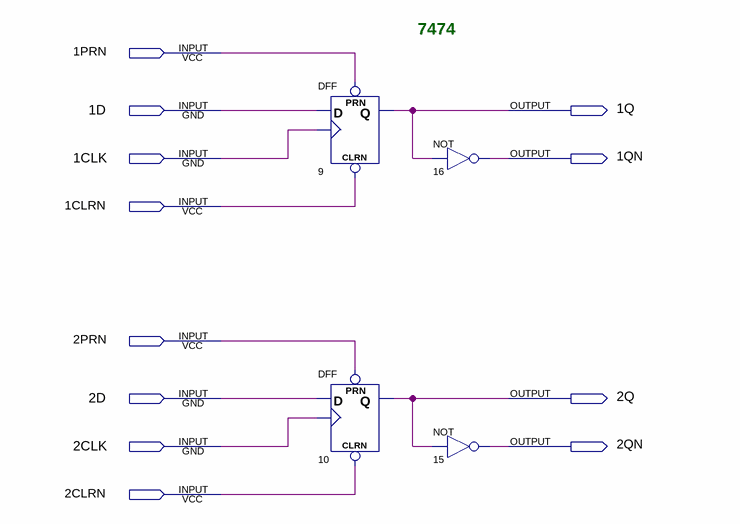
[diagram p0: schematic sheet]
// Quartus schematic 7474.bdf as structural Verilog: 4 symbols, 12 pins
module \7474  (
  input  \1PRN ,
  input  \1D ,
  input  \1CLK ,
  input  \1CLRN ,
  input  \2PRN ,
  input  \2D ,
  input  \2CLK ,
  input  \2CLRN ,
  output \1Q ,
  output \1QN ,
  output \2Q ,
  output \2QN 
);

  DFF u_9 (.CLRN(\1CLRN ), .CLK(\1CLK ), .D(\1D ), .PRN(\1PRN ), .Q(\1Q ));
  DFF u_10 (.CLRN(\2CLRN ), .CLK(\2CLK ), .D(\2D ), .PRN(\2PRN ), .Q(\2Q ));
  not u_16 (\1QN , \1Q );
  not u_15 (\2QN , \2Q );

  // Notes on the sheet:
  //   7474
endmodule
